# EAGLE design ThermoActuator (EAGLE 7.4.0)
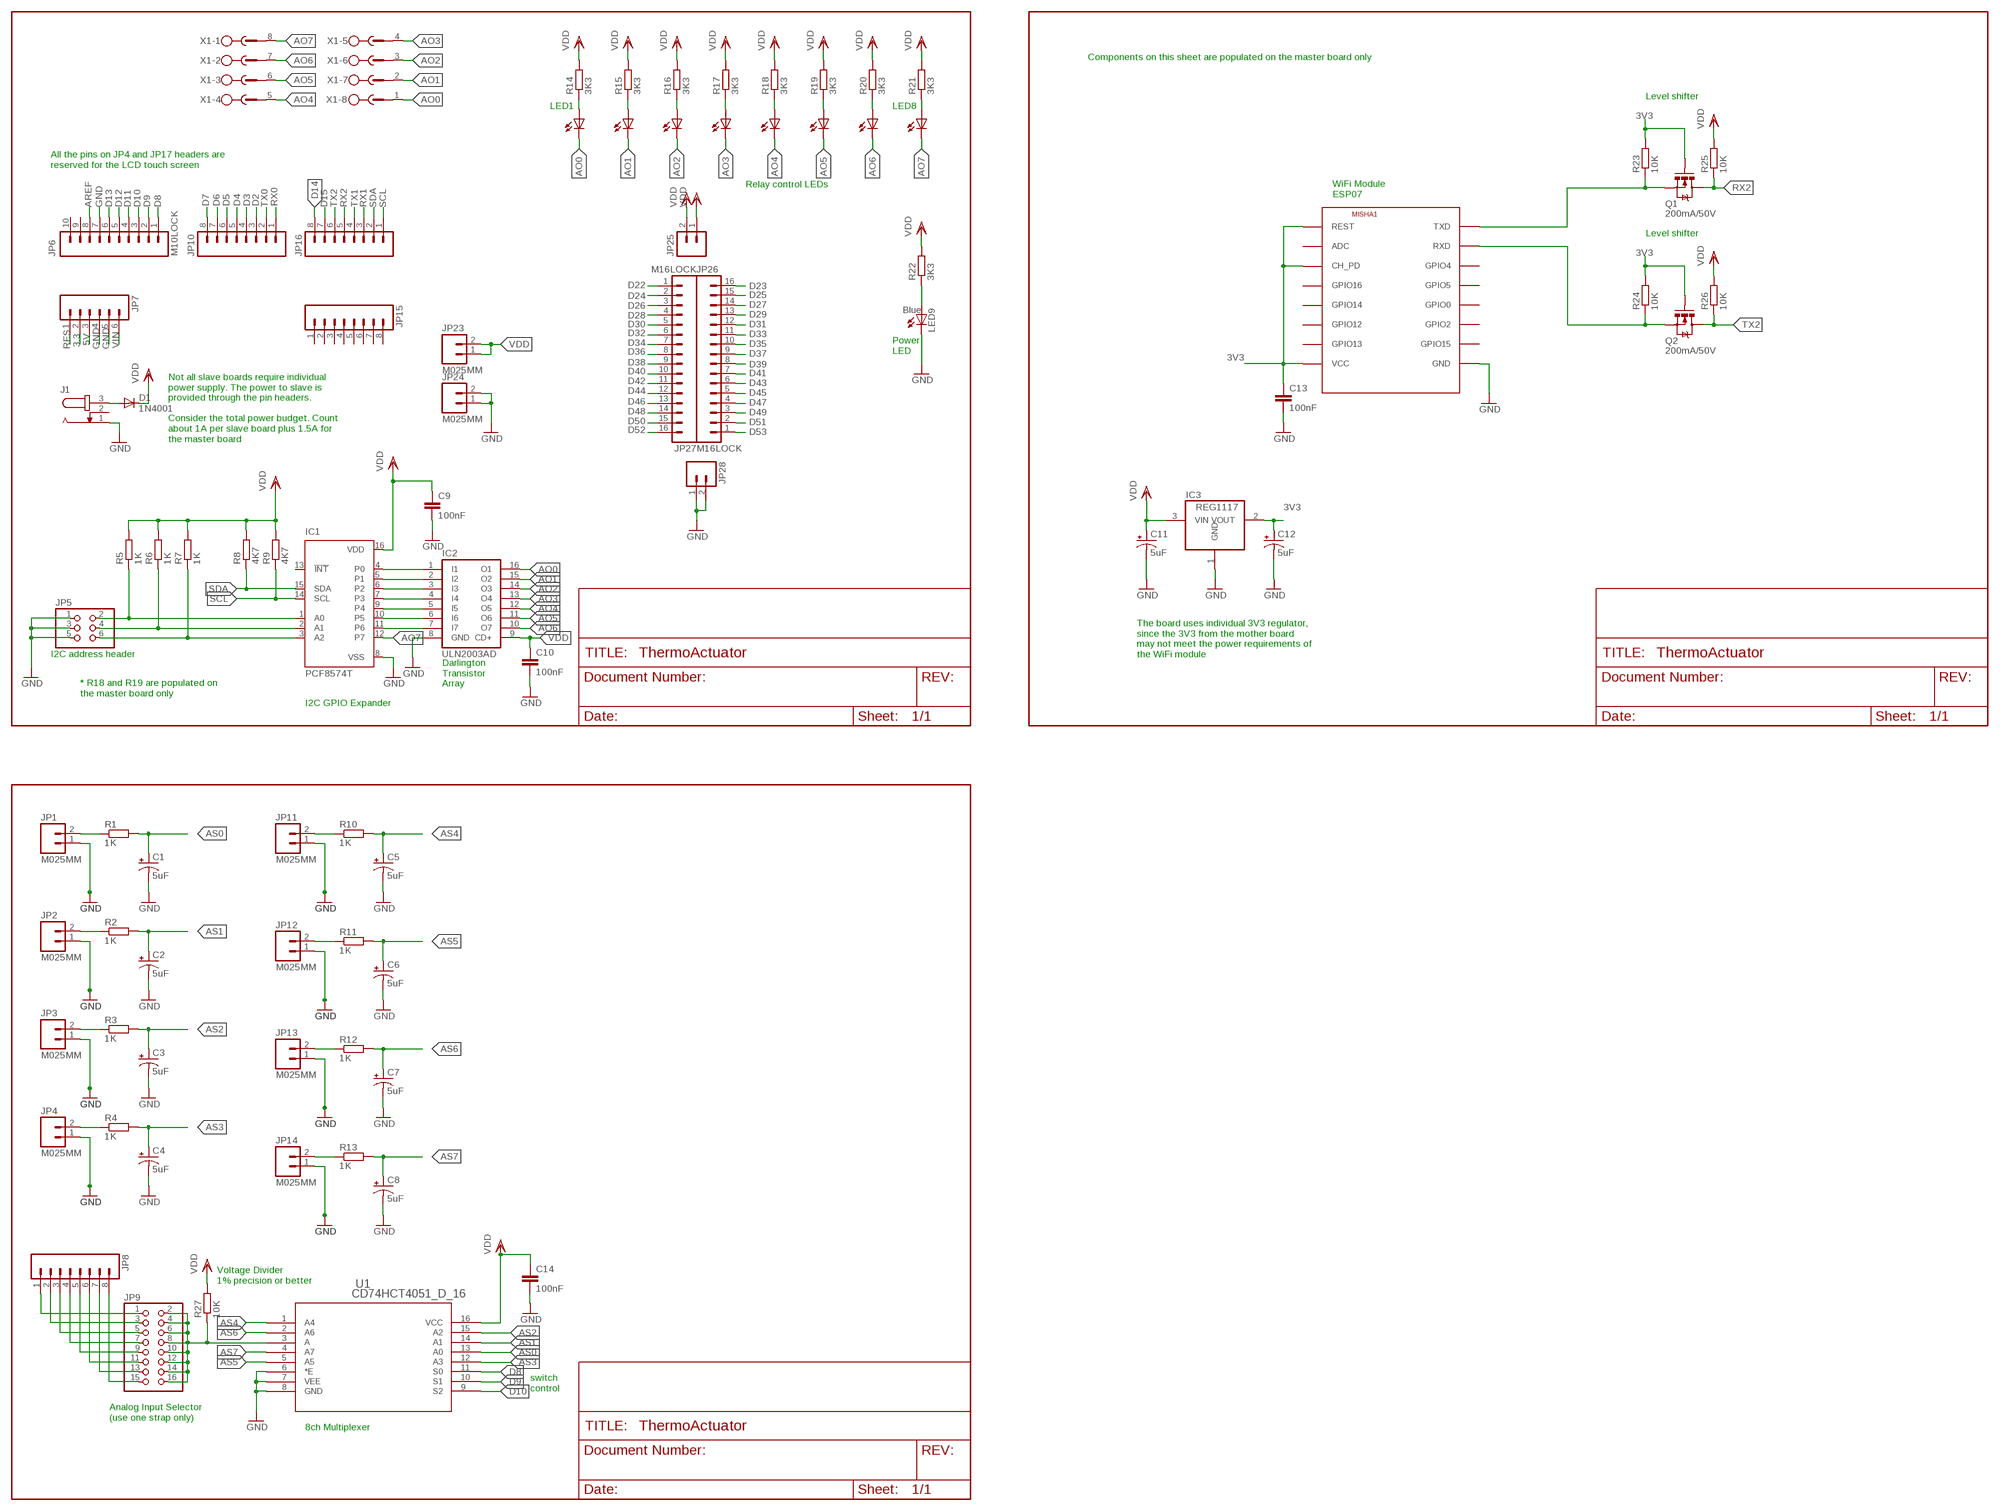
[diagram p0: schematic, sheet 1]

## Parts
1  LEDCHIP-LED0805  [CHIP-LED0805]
2  LEDCHIP-LED0805  [CHIP-LED0805]
3  LEDCHIP-LED0805  [CHIP-LED0805]
4  LEDCHIP-LED0805  [CHIP-LED0805]
5  LEDCHIP-LED0805  [CHIP-LED0805]
6  LEDCHIP-LED0805  [CHIP-LED0805]
7  LEDCHIP-LED0805  [CHIP-LED0805]
8  LEDCHIP-LED0805  [CHIP-LED0805]
C1  5uF  CAP_POL1206  [EIA3216]
C2  5uF  CAP_POL1206  [EIA3216]
C3  5uF  CAP_POL1206  [EIA3216]
C4  5uF  CAP_POL1206  [EIA3216]
C5  5uF  CAP_POL1206  [EIA3216]
C6  5uF  CAP_POL1206  [EIA3216]
C7  5uF  CAP_POL1206  [EIA3216]
C8  5uF  CAP_POL1206  [EIA3216]
C9  100nF  C-EUC0805  [C0805]
C10  100nF  C-EUC0805  [C0805]
C11  5uF  CAP_POL1206  [EIA3216]
C12  5uF  CAP_POL1206  [EIA3216]
C13  100nF  C-EUC0805  [C0805]
C14  100nF  C-EUC0805  [C0805]
D1  1N4001  DIODE-D-10  [D-10]
IC1  PCF8574T  [SO16W]
IC2  ULN2003AD  [SO16]
IC3  REG1117  [SOT223]
J1  JACK-PLUG1  [SPC4078]
JP1  M025MM  [SCREWTERMINAL-5MM-2]
JP2  M025MM  [SCREWTERMINAL-5MM-2]
JP3  M025MM  [SCREWTERMINAL-5MM-2]
JP4  M025MM  [SCREWTERMINAL-5MM-2]
JP5  PINHD-2X3  [2X03]
JP6  M10LOCK  [1X10_LOCK]
JP7  M06LOCK  [1X06_LOCK]
JP8  M08LOCK  [1X08_LOCK]
JP9  PINHD-2X8  [2X08]
JP10  M08LOCK  [1X08_LOCK]
JP11  M025MM  [SCREWTERMINAL-5MM-2]
JP12  M025MM  [SCREWTERMINAL-5MM-2]
JP13  M025MM  [SCREWTERMINAL-5MM-2]
JP14  M025MM  [SCREWTERMINAL-5MM-2]
JP15  M08LOCK  [1X08_LOCK]
JP16  M08LOCK  [1X08_LOCK]
JP23  M025MM  [SCREWTERMINAL-5MM-2]
JP24  M025MM  [SCREWTERMINAL-5MM-2]
JP25  M02LOCK  [1X02_LOCK]
JP26  M16LOCK  [1X16_LOCK]
JP27  M16LOCK  [1X16_LOCK]
JP28  M02LOCK  [1X02_LOCK]
LED9  Blue  LEDCHIP-LED0805  [CHIP-LED0805]
MISHA1  ESP8266-07  [ESP-07]
Q1  200mA/50V  MOSFET-NCHANNELBSS138  [SOT23-3]
Q2  200mA/50V  MOSFET-NCHANNELBSS138  [SOT23-3]
R1  1K  R-EU_R1206  [R1206]
R2  1K  R-EU_R1206  [R1206]
R3  1K  R-EU_R1206  [R1206]
R4  1K  R-EU_R1206  [R1206]
R5  1K  R-EU_R0805  [R0805]
R6  1K  R-EU_R0805  [R0805]
R7  1K  R-EU_R0805  [R0805]
R8  4K7  R-EU_R0805  [R0805]
R9  4K7  R-EU_R0805  [R0805]
R10  1K  R-EU_R1206  [R1206]
R11  1K  R-EU_R1206  [R1206]
R12  1K  R-EU_R1206  [R1206]
R13  1K  R-EU_R1206  [R1206]
R14  3K3  R-EU_R0805  [R0805]
R15  3K3  R-EU_R0805  [R0805]
R16  3K3  R-EU_R0805  [R0805]
R17  3K3  R-EU_R0805  [R0805]
R18  3K3  R-EU_R0805  [R0805]
R19  3K3  R-EU_R0805  [R0805]
R20  3K3  R-EU_R0805  [R0805]
R21  3K3  R-EU_R0805  [R0805]
R22  3K3  R-EU_R0805  [R0805]
R23  10K  R-EU_R0805  [R0805]
R24  10K  R-EU_R0805  [R0805]
R25  10K  R-EU_R0805  [R0805]
R26  10K  R-EU_R0805  [R0805]
R27  10K  R-EU_R0805  [R0805]
U1  CD74HCT4051_D_16  [D16]
X1  MSTBV8  [MSTBV8]

## Nets
3.3: JP7.2
3V3: C12.A(+) C13.1 IC3.2(VOUT) MISHA1.CH_PD MISHA1.REST MISHA1.VCC Q1.1(G) Q2.1(G) R23.2 R24.2
5V: JP7.3
AO0: 1.C IC2.16(O1) X1.1
AO1: 2.C IC2.15(O2) X1.2
AO2: 3.C IC2.14(O3) X1.3
AO3: 4.C IC2.13(O4) X1.4
AO4: 5.C IC2.12(O5) X1.5
AO5: 6.C IC2.11(O6) X1.6
AO6: 7.C IC2.10(O7) X1.7
AO7: 8.C IC1.12(P7) X1.8
AREF: JP6.8
AS0: C1.A(+) R1.2 U1.13(A0)
AS1: C2.A(+) R2.2 U1.14(A1)
AS2: C3.A(+) R3.2 U1.15(A2)
AS3: C4.A(+) R4.2 U1.12(A3)
AS4: C5.A(+) R10.2 U1.1(A4)
AS5: C6.A(+) R11.2 U1.5(A5)
AS6: C7.A(+) R12.2 U1.2(A6)
AS7: C8.A(+) R13.2 U1.4(A7)
D2: JP10.3
D3: JP10.4
D4: JP10.5
D5: JP10.6
D6: JP10.7
D7: JP10.8
D8: JP6.1 U1.11(S0)
D9: JP6.2 U1.10(S1)
D10: JP6.3 U1.9(S2)
D11: JP6.4
D12: JP6.5
D13: JP6.6
D14: JP16.8
D15: JP16.7
D22: JP27.1
D23: JP26.16
D24: JP27.2
D25: JP26.15
D26: JP27.3
D27: JP26.14
D28: JP27.4
D29: JP26.13
D30: JP27.5
D31: JP26.12
D32: JP27.6
D33: JP26.11
D34: JP27.7
D35: JP26.10
D36: JP27.8
D37: JP26.9
D38: JP27.9
D39: JP26.8
D40: JP27.10
D41: JP26.7
D42: JP27.11
D43: JP26.6
D44: JP27.12
D45: JP26.5
D46: JP27.13
D47: JP26.4
D48: JP27.14
D49: JP26.3
D50: JP27.15
D51: JP26.2
D52: JP27.16
D53: JP26.1
GND: C1.C(-) C2.C(-) C3.C(-) C4.C(-) C5.C(-) C6.C(-) C7.C(-) C8.C(-) C9.2 C10.2 C11.C(-) C12.C(-) C13.2 C14.2 IC1.8(VSS) IC2.8(GND) IC3.1(GND) J1.1 JP1.1 JP2.1 JP3.1 JP4.1 JP5.1 JP5.3 JP5.5 JP6.7 JP7.4 JP7.5 JP11.1 JP12.1 JP13.1 JP14.1 JP24.1 JP24.2 JP28.1 JP28.2 LED9.C MISHA1.GND U1.6(*E) U1.7(VEE) U1.8(GND)
N$1: JP1.2 R1.1
N$2: JP2.2 R2.1
N$3: IC1.4(P0) IC2.1(I1)
N$4: IC1.5(P1) IC2.2(I2)
N$5: IC1.6(P2) IC2.3(I3)
N$6: IC1.7(P3) IC2.4(I4)
N$7: IC1.9(P4) IC2.5(I5)
N$8: IC1.10(P5) IC2.6(I6)
N$9: IC1.11(P6) IC2.7(I7)
N$10: IC1.1(A0) JP5.2 R5.1
N$11: JP3.2 R3.1
N$12: JP4.2 R4.1
N$13: 1.A R14.1
N$14: 2.A R15.1
N$15: 3.A R16.1
N$16: 4.A R17.1
N$17: 5.A R18.1
N$18: 6.A R19.1
N$19: 7.A R20.1
N$20: JP11.2 R10.1
N$21: JP12.2 R11.1
N$22: JP13.2 R12.1
N$23: JP14.2 R13.1
N$24: IC1.2(A1) JP5.4 R6.1
N$25: IC1.3(A2) JP5.6 R7.1
N$26: JP8.1 JP9.1
N$27: JP8.2 JP9.3
N$28: JP8.3 JP9.5
N$29: JP8.4 JP9.7
N$30: JP8.5 JP9.9
N$31: JP8.6 JP9.11
N$32: 8.A R21.1
N$36: JP9.2 JP9.4 JP9.6 JP9.8 JP9.10 JP9.12 JP9.14 JP9.16 R27.1 U1.3(A)
N$37: JP8.7 JP9.13
N$38: JP8.8 JP9.15
N$40: MISHA1.TXD Q1.2(S) R23.1
N$41: MISHA1.RXD Q2.2(S) R24.1
N$42: D1.A J1.3
N$126: LED9.A R22.1
RES: JP7.1
RX0: JP10.1
RX1: JP16.3
RX2: JP16.5 Q1.3(D) R25.1
SCL: IC1.14(SCL) JP16.1 R9.1
SDA: IC1.15(SDA) JP16.2 R8.1
TX0: JP10.2
TX1: JP16.4
TX2: JP16.6 Q2.3(D) R26.1
VDD: C9.1 C10.1 C11.A(+) C14.1 D1.C IC1.16(VDD) IC2.9(CD+) IC3.3(VIN) JP23.1 JP23.2 JP25.1 JP25.2 R5.2 R6.2 R7.2 R8.2 R9.2 R14.2 R15.2 R16.2 R17.2 R18.2 R19.2 R20.2 R21.2 R22.2 R25.2 R26.2 R27.2 U1.16(VCC)
VIN: JP7.6
Unconnected: IC1.13(!INT) J1.2 JP6.9 JP6.10 JP15.1 JP15.2 JP15.3 JP15.4 JP15.5 JP15.6 JP15.7 JP15.8 MISHA1.ADC MISHA1.GPIO0 MISHA1.GPIO2 MISHA1.GPIO4 MISHA1.GPIO5 MISHA1.GPIO12 MISHA1.GPIO13 MISHA1.GPIO14 MISHA1.GPIO15 MISHA1.GPIO16

## Notes on the sheet
- Components on this sheet are populated on the master board only
- Level shifter
- LED1 | LED8
- All the pins on JP4 and JP17 headers are 
  reserved for the LCD touch screen
- Relay control LEDs
- WiFi Module
  ESP07
- Level shifter
- Power 
  LED
- Not all slave boards require individual
  power supply. The power to slave is
  provided through the pin headers.
  
  Consider the total power budget. Count 
  about 1A per slave board plus 1.5A for 
  the master board
- I2C address header
- The board uses individual 3V3 regulator,
  since the 3V3 from the mother board
  may not meet the power requirements of 
  the WiFi module
- Darlington 
  Transistor 
  Array
- * R18 and R19 are populated on 
  the master board only
- I2C GPIO Expander
- Voltage Divider
  1% precision or better
- switch
  control
- Analog Input Selector
  (use one strap only)
- 8ch Multiplexer

## Library data of the parts
1-8 LED9 = led:LED: LED OSRAM: - CHIPLED LG R971, LG N971, LY N971, LG Q971, LY Q971, LO R971, LY R971 LH N974, LH R974 LS Q976, LO Q976, LY Q976 LO Q996 - Hyper CHIPLED LW Q18S LB Q993, LB Q99A, LB R99A - SideLED LS A670, LO A670, LY A670, LG A670, LP A670 LB A673, LV A673, LT A673, LW A673 LH A674 LY A675 LS A676, LA A676, LO A676, LY A676, LW A676 LS A679, LY A679, LG A679 - Hyper Micro SIDELED® LS Y876, LA Y876, LO Y876, LY Y876 LT Y87S - SmartLED LW L88C, LW L88S LB L89C, LB L89S, LG L890 LS L89K, LO L89K, LY L89K LS L896, LA L896, LO L896, LY L896 - TOPLED LS T670, LO T670, LY T670, LG T670, LP T670 LSG T670, LSP T670, LSY T670, LOP T670, LYG T670 LG T671, LOG T671, LSG T671 LB T673, LV T673, LT T673, LW T673 LH T674 LS T676, LA T676, LO T676, LY T676, LB T676, LH T676, LSB T676, LW T676 LB T67C, LV T67C, LT T67C, LS T67K, LO T67K, LY T67K, LW E67C LS E67B, LA E67B, LO E67B, LY E67B, LB E67C, LV E67C, LT E67C LW T67C LS T679, LY T679, LG T679 LS T770, LO T770, LY T770, LG T770, LP T770 LB T773, LV T773, LT T773, LW T773 LH T774 LS E675, LA E675, LY E675, LS T675 LS T776, LA T776, LO T776, LY T776, LB T776 LHGB T686 LT T68C, LB T68C - Hyper Mini TOPLED® LB M676 - Mini TOPLED Santana® LG M470 LS M47K, LO M47K, LY M47K Source: http://www.osram.convergy.de LUXEON: - LUMILED® LXK2-PW12-R00, LXK2-PW12-S00, LXK2-PW14-U00, LXK2-PW14-V00 LXK2-PM12-R00, LXK2-PM12-S00, LXK2-PM14-U00 LXK2-PE12-Q00, LXK2-PE12-R00, LXK2-PE12-S00, LXK2-PE14-T00, LXK2-PE14-U00 LXK2-PB12-K00, LXK2-PB12-L00, LXK2-PB12-M00, LXK2-PB14-N00, LXK2-PB14-P00, LXK2-PB14-Q00 LXK2-PR12-L00, LXK2-PR12-M00, LXK2-PR14-Q00, LXK2-PR14-R00 LXK2-PD12-Q00, LXK2-PD12-R00, LXK2-PD12-S00 LXK2-PH12-R00, LXK2-PH12-S00 LXK2-PL12-P00, LXK2-PL12-Q00, LXK2-PL12-R00 Source: www.luxeon.com KINGBRIGHT: KA-3528ASYC Source: www.kingbright.com
C1-C8 C11 C12 = SparkFun-Capacitors:CAP_POL: Capacitor Polarized These are standard SMD and PTH capacitors. Normally 10uF, 47uF, and 100uF in electrolytic and tantalum varieties. Always verify the external diameter of the through hole cap, it varies with capacity, voltage, and manufacturer. The EIA devices should be standard.
C9 C10 C13 C14 = rcl:C-EU: CAPACITOR, European symbol
D1 = diode:DIODE-: DIODE
IC1 = micro-philips:PCF8574: I2C-Bus Remote 8-bit I/O expander http://www.semiconductors.philips.com/acrobat_download/datasheets/PCF8574_4.pdf; MPN: PCF8574T/3,512; OC_FARNELL: 1201255; OC_NEWARK: 70R6870
IC2 = uln-udn:ULN2003A: DRIVER ARRAY
IC3 = burr-brown:REG1117: 800mA and 1A Low Dropout (LDO) Positive Regulator 1.8V, 2.5V, 2.85V, 3.3V, 5V, and Adj; MPN: REG1117; OC_FARNELL: 1097566; OC_NEWARK: 14P6981
J1 = con-jack:JACK-PLUG: DC POWER JACK Power Jack, DC, Right Angle, Through Hole, Rated 5A at 16VDC, PC Terminals Distributor: Farnell (www.Farnell.de) Drawing: 84N1161.pdf / 84N1162.pdf Manufacturer: SPC Technology (www.spctechnology.com) Type: SPC4077 / SPC 4078; OC_FARNELL: unknown; OC_NEWARK: unknown
JP1-JP4 JP11-JP14 JP23 JP24 = SparkFun-Connectors:M02: Standard 2-pin 0.1" header. Use with - straight break away headers ( PRT-00116) - right angle break away headers (PRT-00553) - swiss pins (PRT-00743) - machine pins (PRT-00117) - female headers (PRT-00115) Molex polarized connector foot print use with: PRT-08233 with associated crimp pins and housings. 2.54_SCREWTERM for use with PRT-10571. 3.5mm Screw Terminal footprints for PRT-08084 5mm Screw Terminal footprints for use with PRT-08432; STOREFRONT_ID: PRT-08432
JP5 = pinhead:PINHD-2X3: PIN HEADER
JP6 = SparkFun-Connectors:M10: Header 10 Standard 10-pin 0.1" header. Use with straight break away headers (SKU : PRT-00116), right angle break away headers (PRT-00553), swiss pins (PRT-00743), machine pins (PRT-00117), and female headers (PRT-00115).
JP7 = SparkFun:M06: Header 6 Standard 6-pin 0.1" header. Use with straight break away headers (SKU : PRT-00116), right angle break away headers (PRT-00553), swiss pins (PRT-00743), machine pins (PRT-00117), and female headers (PRT-00115). Molex polarized connector foot print use with SKU : PRT-08094 with associated crimp pins and housings. NOTES ON THE VARIANTS LOCK and LOCK_LONGPADS... This footprint was designed to help hold the alignment of a through-hole component (i.e. 6-pin header) while soldering it into place. You may notice that each hole has been shifted either up or down by 0.005 of an inch from it's more standard position (which is a perfectly straight line). This slight alteration caused the pins (the squares in the middle) to touch the edges of the holes. Because they are alternating, it causes a "brace" to hold the component in place. 0.005 has proven to be the perfect amount of "off-center" position when using our standard breakaway headers. Although looks a little odd when you look at the bare footprint, once you have a header in there, the alteration is very hard to notice. Also, if you push a header all the way into place, it is covered up entirely on the bottom side. This idea of altering the position of holes to aid alignment will be further integrated into the Sparkfun Library for other footprints. It can help hold any component with 3 or more connection pins.
JP8 JP10 JP15 JP16 = SparkFun:M08: Header 8 Standard 8-pin 0.1" header. Use with straight break away headers (SKU : PRT-00116), right angle break away headers (PRT-00553), swiss pins (PRT-00743), machine pins (PRT-00117), and female headers (PRT-00115).
JP9 = pinhead:PINHD-2X8: PIN HEADER
JP25 JP28 = SparkFun:M02: Header 2 Standard 2-pin 0.1" header. Use with straight break away headers (SKU : PRT-00116), right angle break away headers (PRT-00553), swiss pins (PRT-00743), machine pins (PRT-00117), and female headers (PRT-00115). Molex polarized connector foot print use with SKU : PRT-08233 with associated crimp pins and housings.
JP26 JP27 = SparkFun:M16
MISHA1 = lio:ESP8266
Q1 Q2 = SparkFun-DiscreteSemi:MOSFET-NCHANNEL: Common NMOSFET Parts MFG P/N Store ID Prod ID FDD8780 TRANS-09984 SI7820DN TRANS-11055 FDS6630A IC-08089 2N7002PW TRANS-11151 FQP30N06L COM-10213 TRANS-10060 BSS123LT1G TRANS-08345 BSS138 TRANS-00830 BS170 2N7000; PROD_ID: TRANS-00830
R1-R26 = rcl:R-EU_: RESISTOR, European symbol
R27 = resistor:R-EU_: RESISTOR, European symbol
U1 = misha-74HCT4051:CD74HCT4051_D_16; DATASHEETURL: http://www.ti.com/lit/gpn/CD74HCT4051; DESCRIPTION: High Speed CMOS 8-Channel Analog Multiplexer/Demultiplexer with TTL inputs; FAMILY_NAME: ANALOG SWITCH/MULTIPLEXER(less than or equal to 5V); GENERIC_PART_NUMBER: CD74HCT4051; INDUSTRY_STD_PKG_TYPE: SOIC; MANUFACTURER: Texas Instruments; PACKAGE_DESIGNATOR: D; PIN_COUNT: 16
X1 = con-phoenix-500:MSTBV8: PHOENIX; OC_FARNELL: unknown; OC_NEWARK: unknown

## Board
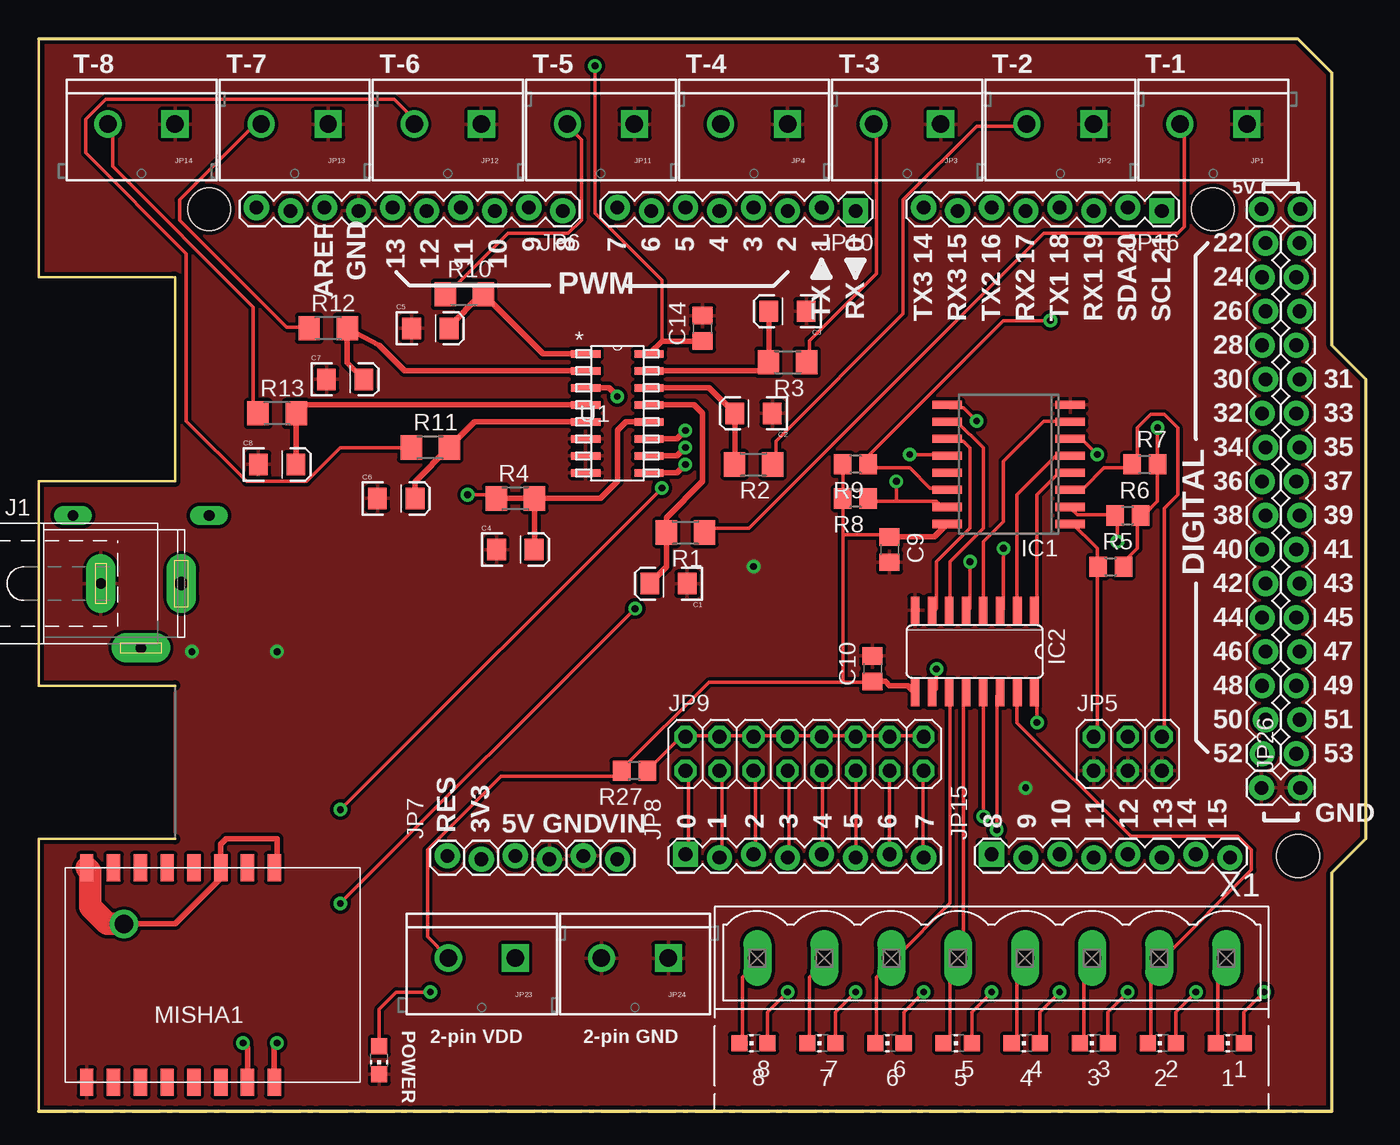
[diagram p1: board, top side]
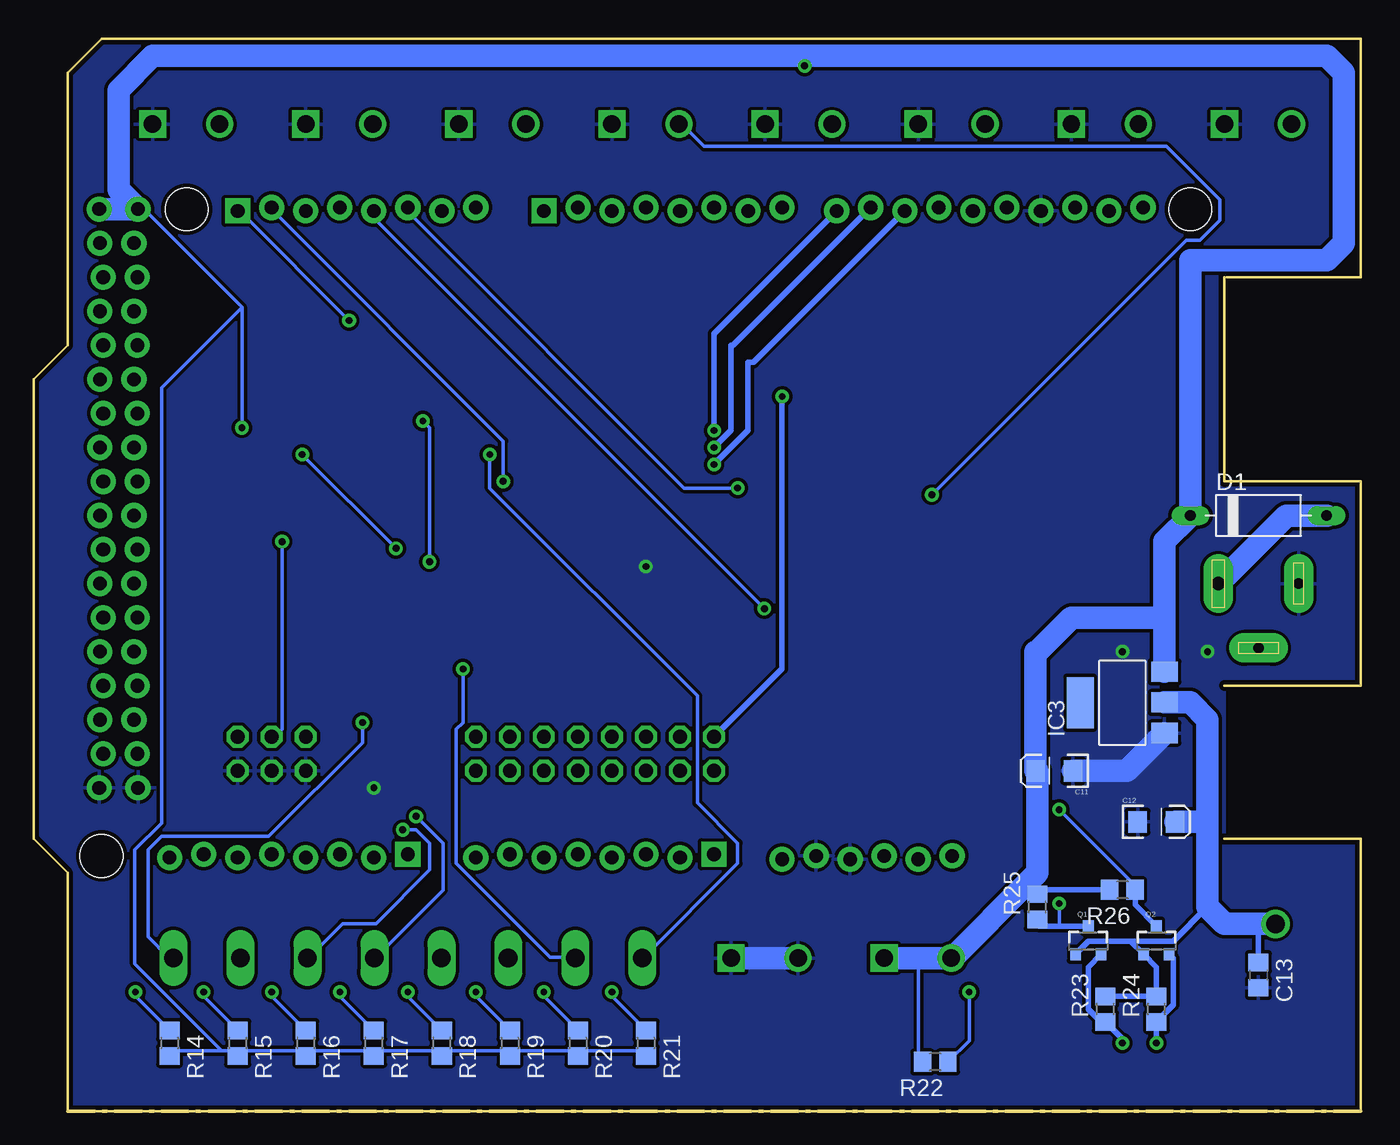
[diagram p2: board, bottom side, seen from below]

Size 99.06 x 80.01 mm. Coordinates in mm from the lower left corner, seen from the top.
Outline: 0,0 96.52,0
Outline: 96.52,0 96.52,17.78 99.06,20.32 99.06,54.61 96.52,57.15 96.52,77.47 93.98,80.01 0,80.01 0,62.23 10,62.23
Outline: 0,0 96.52,0
Outline: 0,47 10.16,47 10.16,62.23
Outline: 0,0 0,20.32 10.16,20.32
Outline: 0,46.99 0,31.75 10.16,31.75
Copper layers (1*16): Top 0.035mm / dielectric 1.5mm / Bottom 0.035mm
Design rules "SparkFun *": minimum track width 10mil, minimum drill 20mil, track to track 10mil, track to pad 10mil, pad to pad 10mil, via to via 10mil, smd to smd 10mil, copper to edge 12mil, drill to drill 10mil, minimum pad ring 12mil, minimum via ring 10mil, stop-mask expansion 4mil, vias tented up to drill 25mil, thermal gap 10mil
Holes 3.2 mm at 12.7,67.31 87.63,67.31 93.98,19.05

### Footprints (pad centres in the part's own frame; a part is rotated, then mirrored left to right if it is on the bottom)
CHIP-LED0805 = smd 1.2 x 1.2: A 0,-1.05; C 0,1.05
EIA3216 = smd 1.4 x 1.6: A 1.4,0; C -1.4,0
C0805 = smd 1.3 x 1.5: 1 -0.95,0; 2 0.95,0
D-10 = drill 0.813 long: A 5.08,0; C -5.08,0
SO16W = smd 0.6 x 2.2: 1 -4.445,-4.6; 2 -3.175,-4.6; 3 -1.905,-4.6; 4 -0.635,-4.6; 5 0.635,-4.6; 6 1.905,-4.6; 7 3.175,-4.6; 8 4.445,-4.6; 9 4.445,4.6; 10 3.175,4.6; 11 1.905,4.6; 12 0.635,4.6; 13 -0.635,4.6; 14 -1.905,4.6; 15 -3.175,4.6; 16 -4.445,4.6
SO16 = smd 0.66 x 2.032: 1 -4.445,-3.073; 2 -3.175,-3.073; 3 -1.905,-3.073; 4 -0.635,-3.073; 5 0.635,-3.073; 6 1.905,-3.073; 7 3.175,-3.073; 8 4.445,-3.073; 9 4.445,3.073; 10 3.175,3.073; 11 1.905,3.073; 12 0.635,3.073; 13 -0.635,3.073; 14 -1.905,3.073; 15 -3.175,3.073; 16 -4.445,3.073
SOT223 = smd 1.499 x 2.007: 1 -2.261,-3.15; 2 0.025,-3.15; 3 2.311,-3.15 | smd 3.81 x 2.007: 4 0,3.15
SPC4078 = drill 0.8 pad 2.184 long: 1 -3,0; 2 0,-4.8 | drill 1 pad 2.184 long: 3 3,0
SCREWTERMINAL-5MM-2 = drill 1.3 pad 2.032 square: 1 0,0 | drill 1.3 pad 2.032: 2 5,0
2X03 = drill 1.016 octagon: 1 -2.54,-1.27; 2 -2.54,1.27; 3 0,-1.27; 4 0,1.27; 5 2.54,-1.27; 6 2.54,1.27
1X10_LOCK = drill 1.016 pad 1.88: 1 0,0.127; 2 2.54,-0.127; 3 5.08,0.127; 4 7.62,-0.127; 5 10.16,0.127; 6 12.7,-0.127; 7 15.24,0.127; 8 17.78,-0.127; 9 20.32,0.127; 10 22.86,-0.127
1X06_LOCK = drill 1.016 pad 1.88: 1 0,0; 2 2.54,-0.254; 3 5.08,0; 4 7.62,-0.254; 5 10.16,0; 6 12.7,-0.254
1X08_LOCK = drill 1.016 pad 1.88 square: 1 0,0.127 | drill 1.016 pad 1.88: 2 2.54,-0.127; 3 5.08,0.127; 4 7.62,-0.127; 5 10.16,0.127; 6 12.7,-0.127; 7 15.24,0.127; 8 17.78,-0.127
2X08 = drill 1.016 octagon: 1 -8.89,-1.27; 2 -8.89,1.27; 3 -6.35,-1.27; 4 -6.35,1.27; 5 -3.81,-1.27; 6 -3.81,1.27; 7 -1.27,-1.27; 8 -1.27,1.27; 9 1.27,-1.27; 10 1.27,1.27; 11 3.81,-1.27; 12 3.81,1.27; 13 6.35,-1.27; 14 6.35,1.27; 15 8.89,-1.27; 16 8.89,1.27
1X02_LOCK = drill 1.016 pad 1.88: 1 -0.178,0; 2 2.718,0
1X16_LOCK = drill 1.016 pad 1.88: 1 0,0.127; 2 2.54,-0.127; 3 5.08,0.127; 4 7.62,-0.127; 5 10.16,0.127; 6 12.7,-0.127; 7 15.24,0.127; 8 17.78,-0.127; 9 20.32,0.127; 10 22.86,-0.127; 11 25.4,0.127; 12 27.94,-0.127; 13 30.48,0.127; 14 33.02,-0.127; 15 35.56,0.127; 16 38.1,-0.127
ESP-07 = smd 1 x 2: ADC -1.6,-8; CH_PD 0.4,-8; GND 10.4,8; GPIO0 4.4,8; GPIO2 6.4,8; GPIO4 0.4,8; GPIO5 2.4,8; GPIO12 6.4,-8; GPIO13 8.4,-8; GPIO14 4.4,-8; GPIO15 8.4,8; GPIO16 2.4,-8; REST -3.6,-8; RXD -1.6,8; TXD -3.6,8; VCC 10.4,-8
SOT23-3 = smd 0.8 x 0.9: 1 -0.95,-1; 2 0.95,-1; 3 0,1.1
R1206 = smd 1.6 x 1.803: 1 -1.422,0; 2 1.422,0
R0805 = smd 1.3 x 1.5: 1 -0.95,0; 2 0.95,0
D16 = smd 2.184 x 0.559: 1 -2.362,4.445; 2 -2.362,3.175; 3 -2.362,1.905; 4 -2.362,0.635; 5 -2.362,-0.635; 6 -2.362,-1.905; 7 -2.362,-3.175; 8 -2.362,-4.445; 9 2.362,-4.445; 10 2.362,-3.175; 11 2.362,-1.905; 12 2.362,-0.635; 13 2.362,0.635; 14 2.362,1.905; 15 2.362,3.175; 16 2.362,4.445
MSTBV8 = drill 1.397 long: 1 -17.501,0; 2 -12.497,0; 3 -7.493,0; 4 -2.489,0; 5 2.515,0; 6 7.493,0; 7 12.497,0; 8 17.501,0

### Placement (x,y rotation side)
1  88.9,5.08 90 top
2  83.82,5.08 90 top
3  78.74,5.08 90 top
4  73.66,5.08 90 top
5  68.58,5.08 90 top
6  63.5,5.08 90 top
7  58.42,5.08 90 top
8  53.34,5.08 90 top
C1  46.99,39.37 180 top
C2  53.34,52.07 180 top
C3  55.88,59.69 180 top
C4  35.56,41.91 0 top
C5  29.21,58.42 0 top
C6  26.67,45.72 0 top
C7  22.86,54.61 0 top
C8  17.78,48.26 0 top
C9  63.5,41.91 270 top
C10  62.23,33.02 90 top
C11  22.86,25.4 180 bottom
C12  15.24,21.59 0 bottom
C13  7.62,10.16 270 bottom
C14  49.53,58.42 90 top
D1  7.62,44.45 0 bottom
IC1  72.39,48.26 90 top
IC2  69.85,34.29 180 top
IC3  17.78,30.48 90 bottom
J1  7.62,39.37 0 top
JP1  90.17,73.66 180 top
JP2  78.74,73.66 180 top
JP3  67.31,73.66 180 top
JP4  55.88,73.66 180 top
JP5  81.28,26.67 0 top
JP6  39.1,67.31 180 top
JP7  30.48,19.05 0 top
JP8  48.26,19.05 0 top
JP9  57.15,26.67 0 top
JP10  60.96,67.31 180 top
JP11  44.45,73.66 180 top
JP12  33.02,73.66 180 top
JP13  21.59,73.66 180 top
JP14  10.16,73.66 180 top
JP15  71.12,19.05 0 top
JP16  83.82,67.31 180 top
JP23  35.56,11.43 180 top
JP24  46.99,11.43 180 top
JP25  91.44,67.31 0 top
JP26  93.98,26.67 90 top
JP27  91.44,26.67 90 top
JP28  91.44,24.13 0 top
LED9  25.4,3.81 180 top
MISHA1  13.97,10.16 180 top
Q1  20.32,12.7 0 bottom
Q2  15.24,12.7 0 bottom
R1  48.26,43.18 180 top
R2  53.34,48.26 180 top
R3  55.88,55.88 180 top
R4  35.56,45.72 0 top
R5  80.01,40.64 0 top
R6  81.28,44.45 0 top
R7  82.55,48.26 0 top
R8  60.96,45.72 180 top
R9  60.96,48.26 180 top
R10  31.75,60.96 0 top
R11  29.21,49.53 0 top
R12  21.59,58.42 0 top
R13  17.78,52.07 0 top
R14  88.9,5.08 270 bottom
R15  83.82,5.08 270 bottom
R16  78.74,5.08 270 bottom
R17  73.66,5.08 270 bottom
R18  68.58,5.08 270 bottom
R19  63.5,5.08 270 bottom
R20  58.42,5.08 270 bottom
R21  53.34,5.08 270 bottom
R22  31.75,3.68 180 bottom
R23  19.05,7.62 90 bottom
R24  15.24,7.62 90 bottom
R25  24.13,15.24 90 bottom
R26  17.78,16.51 180 bottom
R27  44.45,25.4 180 top
U1  43.18,52.07 0 top
X1  71.12,11.43 180 top

### Tracks (layer width: path | path; a pad name or v marks a point on that pad's centre or on a via)
3V3  (via drill 1.4)
  Top 0.406: v6.35,13.97 10.16,13.97 13.57,17.38 MISHA1.CH_PD 13.57,19.92 13.97,20.32 17.78,20.32 17.78,18.37 MISHA1.REST
  Top 1.676: v6.35,13.97 5.08,13.97 3.81,15.24 3.81,17.92 MISHA1.VCC
  Bottom 0.406: C13.1 7.62,13.97 | 17.19,12.7 Q2.1 15.24,10.75 R24.2 R23.2 | 17.19,12.7 20.32,12.7 21.27,11.75 Q1.1 | 17.19,12.7 13.97,12.7 11.43,15.24
  Bottom 1.676: IC3.2 12.72,30.5 11.43,29.21 11.43,21.59 | 11.43,21.59 11.43,15.24 10.16,13.97 7.62,13.97 v6.35,13.97 | C12.A 11.43,21.59
AO0  (via drill 0.51)
  Top 0.254: v74.5,29 74.5,31 IC2.16 | 1.C 88,5.5 88,10.5 88.5,11 X1.1
  Bottom 0.254: v74.5,29 74.5,27.5 81.5,20.5 89.5,20.5 90.5,19.5 90.5,13 89,11.5 X1.1
AO1
  Top 0.254: IC2.15 73,31 73,29 81.5,20.5 89.5,20.5 90.5,19.5 90.5,18 84,11.5 X1.2 83.5,11 83,10.5 83,5.5 2.C
AO2  (via drill 0.51)
  Top 0.254: v71.5,21 71.5,31 IC2.14 | 3.C 78,5.5 78,10.5 78.5,11 X1.3
  Bottom 0.254: v71.5,21 70.5,21 69.5,20 69.5,18 73.5,14 76,14 78.5,11.5 X1.3
AO3  (via drill 0.51)
  Top 0.254: v70.5,22 70.5,31 IC2.13 | 4.C 73,5.5 73,10.5 73.5,11 X1.4
  Bottom 0.254: v70.5,22 68.5,20 68.5,16.5 73.5,11.5 X1.4
AO4
  Top 0.254: IC2.12 69,31 69,11.5 X1.5 68.5,11 68,10.5 68,5.5 5.C
AO5
  Top 0.254: IC2.11 68,31 68,15.5 64,11.5 X1.6 63.5,11 62.5,10 62.5,5.5 6.C
AO6  (via drill 0.51)
  Top 0.254: v67,33 67,31.5 IC2.10 | 7.C 57.5,5.5 57.5,10 58.5,11 X1.7
  Bottom 0.254: v67,33 67,29 67.5,28.5 67.5,18.5 60.5,11.5 59,11.5 X1.7
AO7  (via drill 0.51)
  Top 0.254: v65,49 67.5,49 IC1.12 | 8.C 52.5,5.5 52.5,10 53.5,11 X1.8
  Bottom 0.254: v65,49 65,46.5 49.5,31 49.5,23 46.5,20 46.5,18.5 53.5,11.5 X1.8
AS0
  Top 0.406: C1.A 46.84,40.62 R1.2 46.84,44.3 49.53,46.99 49.53,52.07 48.9,52.7 U1.13
AS1
  Top 0.406: R2.2 51.94,48.28 C2.A 50.03,53.98 U1.14
AS2
  Top 0.406: C3.A 54.48,56.01 54.61,55.88 R3.2 53.82,55.24 U1.15
AS3
  Top 0.406: C4.A 36.98,41.93 R4.2 41.91,45.72 43.18,46.99 43.18,50.8 43.81,51.44 U1.12
AS4
  Top 0.406: U1.1 37.62,56.52 R10.2 33.02,60.96 30.61,58.55 C5.A
AS5
  Top 0.406: U1.5 32.54,51.44 R11.2 28.07,46.97 C6.A
AS6
  Top 0.406: U1.2 27.3,55.24 25.4,57.15 R12.2 23.01,55.86 C7.A
AS7
  Top 0.406: U1.4 19.84,52.7 R13.2 19.2,48.28 C8.A
D8  (via drill 0.5)
  Top 0.406: U1.11 47.62,50.16 v48.26,50.8
  Bottom 0.406: v48.26,50.8 48.26,58.02 JP6.1
D9  (via drill 0.5)
  Top 0.406: U1.10 47.62,48.9 v48.26,49.53
  Bottom 0.406: v48.26,49.53 46.99,50.8 46.99,57.15 46.85,57.15 JP6.2
D10  (via drill 0.5)
  Top 0.406: U1.9 47.62,47.62 v48.26,48.26
  Bottom 0.406: v48.26,48.26 45.72,50.8 45.72,55.88 45.32,55.88 JP6.3
GND  (via drill 0.5)
  Bottom 1.676: JP24.1 JP24.2 | IC3.1 17.45,25.4 C11.C
  other vias: 11.43,34.29 17.78,34.29 53.34,40.64 73.66,24.13
  pour Bottom: 0,80.01 93.98,80.01 96.52,77.47 96.52,57.15 99.06,54.61 99.06,20.32 96.52,17.78 96.52,0 0,0 0,20.32 10.16,20.32 10.16,31.75 0,31.75 0,46.99 10.16,46.99 10.16,62.23 0,62.23
  pour Top: 0,80.01 93.98,80.01 96.52,77.47 96.52,57.15 99.06,54.61 99.06,20.32 96.52,17.78 96.52,0 0,0 0,20.32 10.16,20.32 10.16,31.75 0,31.75 0,46.99 10.16,46.99 10.16,62.23 0,62.23
N$1
  Top 0.254: R1.1 50,43.5 53,43.5 75,65.5 85,65.5 85.5,66 85.5,73.5 JP1.2
N$2
  Top 0.254: R2.1 55,48.5 55,50 64.5,59.5 64.5,68 70,73.5 73.5,73.5 JP2.2
N$3
  Top 0.254: IC2.1 74.5,37.5 74.5,46 76,47.5 76.5,47.5 IC1.4
N$4
  Top 0.254: IC2.2 73,37.5 73,46 76,49 76.5,49 IC1.5
N$5  (via drill 0.51)
  Top 0.254: v72,42 72,37.5 IC2.3 | v79,49 78,50 77,50 IC1.6
  Bottom 0.254: v79,49 v72,42
N$6
  Top 0.254: IC2.4 70.5,37.5 70.5,42.5 72,44 72,48.5 75,51.5 76.5,51.5 IC1.7
N$7  (via drill 0.51)
  Top 0.254: v69.5,41 69.5,37.5 IC2.5 | v70,51.5 69,52.5 68,52.5 IC1.9
  Bottom 0.254: v69.5,41 69.5,51 v70,51.5
N$8
  Top 0.254: IC2.6 68,37.5 68,41 70.5,43.5 70.5,49.5 68.5,51.5 68,51.5 IC1.10
N$9
  Top 0.254: IC2.7 67,37.5 67,41 69.5,43.5 69.5,49.5 69,50 68,50 IC1.11
N$10
  Top 0.254: IC1.1 77,44 79,42 79,41 R5.1 79,40.5 79,28 JP5.2
N$11
  Top 0.254: R3.1 57.5,56 57.5,57.5 62.5,62.5 62.5,73.5 JP3.2
N$12  (via drill 0.51)
  Top 0.254: v32,46 34,46 R4.1
  Top 0.406: R4.1 36.83,45.72
  Bottom 0.254: v32,46 13,65 12,65 10.5,66.5 10.5,68 14.5,72 49,72 50.5,73.5 JP4.2
N$13  (via drill 0.5)
  Top 0.254: 1.A 89.95,7.4 v91.44,8.89
  Bottom 0.254: v91.44,8.89 91.44,8.57 R14.1
N$14  (via drill 0.5)
  Top 0.254: 2.A 84.87,7.4 v86.36,8.89
  Bottom 0.254: v86.36,8.89 86.36,8.57 R15.1
N$15  (via drill 0.5)
  Top 0.254: 3.A 79.79,7.4 v81.28,8.89
  Bottom 0.254: v81.28,8.89 81.28,8.57 R16.1
N$16  (via drill 0.5)
  Top 0.254: 4.A 74.71,7.4 v76.2,8.89
  Bottom 0.254: v76.2,8.89 76.2,8.57 R17.1
N$17  (via drill 0.5)
  Top 0.254: 5.A 69.63,7.4 v71.12,8.89
  Bottom 0.254: v71.12,8.89 71.12,8.57 R18.1
N$18  (via drill 0.5)
  Top 0.254: 6.A 64.55,7.4 v66.04,8.89
  Bottom 0.254: v66.04,8.89 66.04,8.57 R19.1
N$19  (via drill 0.5)
  Top 0.254: 7.A 59.47,7.4 v60.96,8.89
  Bottom 0.254: 58.42,6.35 R20.1 60.96,8.57 v60.96,8.89
N$20
  Top 0.254: R10.1 30.5,61 35,65.5 39.5,65.5 40.5,66.5 40.5,72.5 39.5,73.5 JP11.2
N$21
  Top 0.254: R11.1 27.5,49.5 22.5,49.5 20,47 15.5,47 11,51.5 11,64 3.5,71.5 3.5,74 5,75.5 26.5,75.5 28,74 JP12.2
N$22
  Top 0.254: R12.1 20,58.5 18.5,58.5 10.5,66.5 10.5,68 16.5,74 JP13.2
N$23
  Top 0.254: R13.1 16,52.5 16,60 5.5,70.5 5.5,73.5 JP14.2
N$24  (via drill 0.51)
  Top 0.254: IC1.2 77,45 77.5,44.5 80,44.5 R6.1 80.5,44 v80.5,42.5
  Bottom 0.254: v80.5,42.5 80.5,28.5 81,28 JP5.4
N$25
  Top 0.254: IC1.3 77,46.5 78,46.5 79.5,48 81.5,48 R7.1 82,48.5 82,51 83,52 84,52 85,51 85,46 84,45 84,28 JP5.6
N$26
  Top 0.254: JP9.1 48.5,25 48.5,19.5 JP8.1
N$27
  Top 0.254: JP9.3 51,25 51,19 JP8.2
N$28
  Top 0.254: JP9.5 53.5,25 53.5,19.5 JP8.3
N$29
  Top 0.254: JP9.7 56,25 56,19 JP8.4
N$30
  Top 0.254: JP9.9 58.5,25 58.5,19.5 JP8.5
N$31
  Top 0.254: JP9.11 61,25 61,19 JP8.6
N$32  (via drill 0.5)
  Top 0.254: 8.A 54.39,7.4 v55.88,8.89
  Bottom 0.254: v55.88,8.89 55.88,8.57 R21.1
N$36  (via drill 0.5)
  Top 0.254: 63.5,28 61,28 JP9.12 60.5,28 58.5,28 JP9.10 58,28 56,28 JP9.8 55.5,28 53.5,28 JP9.6 53,28 51,28 JP9.4 50.5,28 48.5,28 JP9.2 48,28 R27.1 | 63.5,28 66,28 JP9.16 | 63.5,28 JP9.14
  Top 0.406: U1.3 42.55,53.98 v43.18,53.34
  Bottom 0.406: v43.18,53.34 43.18,33.02 JP9.2
N$37
  Top 0.254: JP8.7 JP9.13
N$38
  Top 0.254: JP9.15 66,25 66,19 JP8.8
N$40  (via drill 0.5)
  Top 0.406: v17.78,5.08 17.57,4.87 MISHA1.TXD
  Bottom 0.406: v17.78,5.08 17.78,5.4 R23.1 19.37,6.67 20.32,7.62 20.32,10.75 Q1.2
N$41  (via drill 0.5)
  Top 0.406: v15.24,5.08 15.57,4.75 MISHA1.RXD
  Bottom 0.406: v15.24,5.08 R24.1 13.97,7.94 13.97,11.43 14.24,11.7 Q2.2
N$42
  Bottom 1.676: J1.3 5.54,44.45 D1.A
N$44  (via drill 0.5)
  other vias: 15.24,5.08
N$45  (via drill 0.5)
  other vias: 17.78,5.08
N$46  (via drill 0.5)
  other vias: 43.18,53.34
N$47  (via drill 0.5)
  other vias: 55.88,8.89
N$48  (via drill 0.5)
  other vias: 60.96,8.89
N$49  (via drill 0.5)
  other vias: 66.04,8.89
N$50  (via drill 0.5)
  other vias: 71.12,8.89
N$51  (via drill 0.5)
  other vias: 76.2,8.89
N$52  (via drill 0.5)
  other vias: 81.28,8.89
N$53  (via drill 0.5)
  other vias: 86.36,8.89
N$54  (via drill 0.5)
  other vias: 91.44,8.89
N$126  (via drill 0.5)
  Top 0.254: LED9.A 25.4,7.62 26.67,8.89 v29.21,8.89
  Bottom 0.254: v29.21,8.89 29.21,5.27 R22.1
RX2  (via drill 0.51)
  Top 0.254: v44.5,37.5 v22.5,15.5
  Bottom 0.254: v22.5,15.5 22.5,13.8 | v44.5,37.5 74,67 JP16.5
  Bottom 0.406: R25.1 24.13,13.97 23.96,13.8 22.5,13.8 Q1.3
SCL  (via drill 0.51)
  Top 0.254: IC1.14 67.5,46.5 66.5,46.5 65,48 62,48 R9.1 61.5,48.5 72,59 v75.5,59
  Bottom 0.254: v75.5,59 83.5,67 JP16.1
SDA  (via drill 0.51)
  Top 0.254: 64,45.5 67,45.5 67.5,45 IC1.15 | 64,45.5 62,45.5 R8.1 | 64,45.5 v64,47
  Bottom 0.254: v64,47 64,50 81,67 JP16.2
TX2  (via drill 0.51)
  Top 0.254: v46.5,46.5 v22.5,22.5
  Bottom 0.254: v22.5,22.5 17,17 R26.1 | v46.5,46.5 50.5,46.5 71,67 JP16.6
  Bottom 0.406: Q2.3 16.83,15.39 R26.1
VDD  (via drill 0.51)
  Top 0.254: R9.2 60,48 60,46 R8.2 60,45.5 60,43 | 60,32 62,32 C10.1 | 60,32 50,32 43.5,25.5 R27.2 43.5,25 34.5,25 29,19.5 29,13 30.5,11.5 JP23.2 | 60,32 60,43 | 60,43 63.5,43 C9.1 | R5.2 81,41 82,42 82,44 R6.2 82.5,44.5 83.5,45.5 R7.2 v83.5,51 | v41.5,78 41.5,67 46.5,62 46.5,57.5 46.5,57.47
  Top 0.406: C9.1 66.83,42.86 IC1.16 | C10.1 63.18,32.07 63.5,31.75 64.87,31.75 IC2.9 | C14.1 46.5,57.47 U1.16
  Bottom 0.254: v41.5,78 41.5,78.74 | 83.5,60 v83.5,51 | 83.5,60 90.5,67 JP25.1 | R21.2 53.5,4.5 58,4.5 R20.2 58.5,4.5 63.5,4.5 | 85,4.5 88.5,4.5 R14.2 | 85,4.5 84,4.5 R15.2 83.5,4.5 79,4.5 R16.2 78.5,4.5 74,4.5 R17.2 73.5,4.5 69,4.5 R18.2 68.5,4.5 63.5,4.5 | 63.5,4.5 R19.2 | 33,11.43 33,4 R22.2 | 83.5,60 89.5,54 89.5,21.5 91.5,19.5 91.5,11 85,4.5
  Bottom 0.406: R26.2 23.81,16.51 R25.2 24.77,16.82 24.77,17.14
  Bottom 1.676: 14.63,36.83 14.63,42.52 D1.C 12.7,63.5 2.54,63.5 1.27,64.77 1.27,77.47 2.54,78.74 41.5,78.74 90.17,78.74 92.71,76.2 92.71,68.76 JP25.1 JP25.2 | 14.63,36.83 IC3.3 | JP23.1 33,11.43 JP23.2 30.48,11.43 24.77,17.14 24.13,17.78 24.13,25.4 C11.A 24.26,34.29 24.13,34.29 21.59,36.83 14.63,36.83

### Text on the board
tPlace: 5V | 9 | 8 | 7 | 6 | 5 | 4 | 3 | 2 | 1 | 0 | 22 | 13 | 12 | 11 | 10 | 14 | 15 | 16 | 17 | 18 | 19 | 20 | 21 | GND | 24 | AREF | PWM | TX | RX | TX3 | RX3 | TX2 | RX2 | TX1 | RX1 | SDA | SCL | 26 | 28 | 30 | 31 | 32 | 33 | 34 | 35 | 36 | 37 | 38 | 39 | 40 | 41 | DIGITAL | 42 | 43 | 44 | 45 | 46 | 47 | 48 | 49 | 50 | 51 | 52 | 53 | GND | RES | 3V3 | 5V | GND | VIN | 0 | 1 | 2 | 3 | 4 | 5 | 6 | 7 | 8 | 9 | 10 | 11 | 12 | 13 | 14 | 15 | POWER | 2-pin VDD | 2-pin GND
tNames: T-8 | T-7 | T-6 | T-5 | T-4 | T-3 | T-2 | T-1